# EAGLE design HH1D (EAGLE 9.6.2)
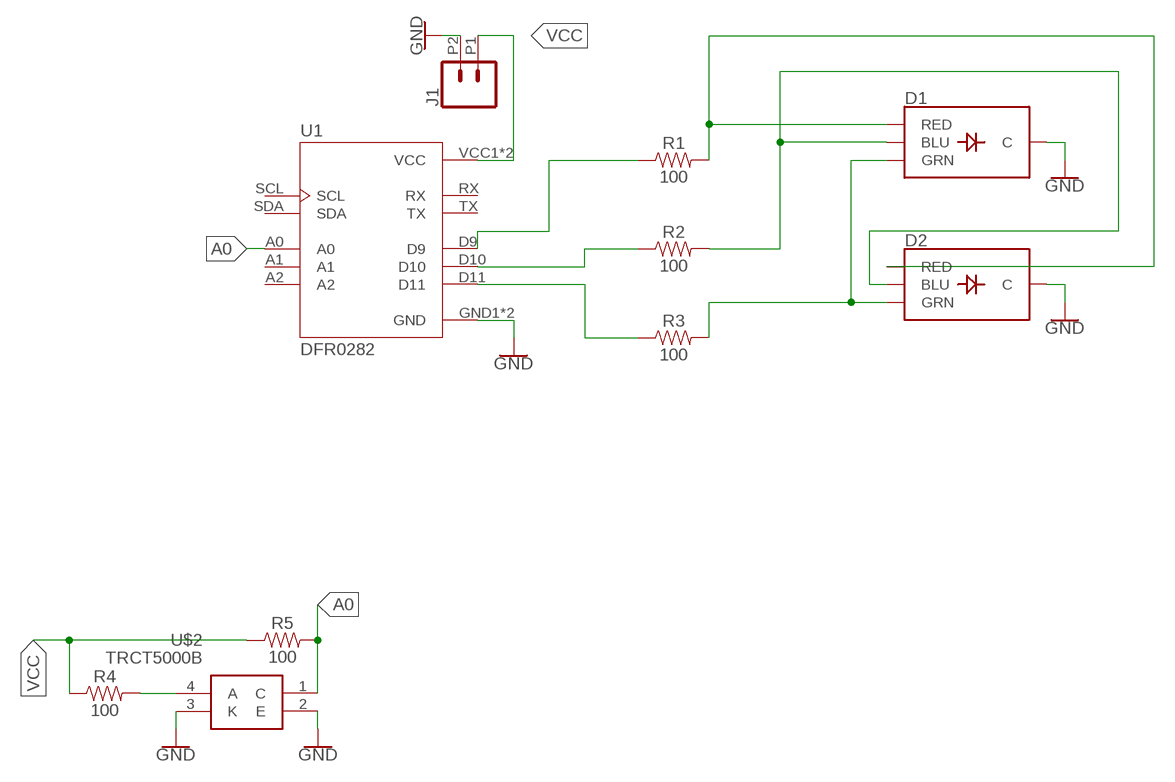
[diagram p0: schematic, sheet 1]

## Parts
D1  LED-RGB-CCPIRANHA  [LED_PIRANHA_5MM]
D2  LED-RGB-CCPIRANHA  [LED_PIRANHA_5MM]
J1  CONN_022.54MM_SCREWTERM  [1X02_2.54_SCREWTERM]
R1  100  100OHM-HORIZ-1/4W-1%  [AXIAL-0.3]
R2  100  100OHM-HORIZ-1/4W-1%  [AXIAL-0.3]
R3  100  100OHM-HORIZ-1/4W-1%  [AXIAL-0.3]
R4  100  100OHM-HORIZ-1/4W-1%  [AXIAL-0.3]
R5  100  100OHM-HORIZ-1/4W-1%  [AXIAL-0.3]
U1  DFR0282  [MODULE_DFR0282]
U$2  TRCT5000B  [TRCT5000B]

## Nets
A0: R5.P$2 U1.A0 U$2.1(C)
GND: D1.-(C) D2.-(C) J1.P2 U1.GND1(GND) U1.GND2(GND) U$2.2(E) U$2.3(K)
N$1: D1.R(RED) D2.R(RED) R1.P$2
N$2: D1.B(BLU) D2.B(BLU) R2.P$2
N$3: D1.G(GRN) D2.G(GRN) R3.P$2
N$4: R4.P$2 U$2.4(A)
N$6: R1.P$1 U1.D9
N$7: R2.P$1 U1.D10
N$9: R3.P$1 U1.D11
VCC: J1.P1 R4.P$1 R5.P$1 U1.VCC1(VCC) U1.VCC2(VCC)
Unconnected: U1.A1 U1.A2 U1.RX U1.SCL U1.SDA U1.TX

## Library data of the parts
D1 D2 = SparkFun-LED:LED-RGB-CC: LED-RGB Common Cathode Packages: LED RGB-THRU LED_PIRANHA_5MM SparkFun Products: RGB Diffused Common Cathode- Diffuse <[https://www.sparkfun.com/products/9264]> RGB Diffused Common Cathode - Clear <[https://www.sparkfun.com/products/105]> LED-RGB 5mm Square (Piranha) <[https://www.sparkfun.com/products/11679]>; SF_ID: COM-11679
J1 = SparkFun-Connectors:CONN_02: Multi connection point. Often used as Generic Header-pin footprint for 0.1 inch spaced/style header connections On any of the 0.1 inch spaced packages, you can populate with these: Break Away Headers - Straight <https://www.sparkfun.com/products/116> (PRT-00116) Break Away Male Headers - Right Angle <https://www.sparkfun.com/products/553> (PRT-00553) Female Headers <https://www.sparkfun.com/products/115> (PRT-00115) Break Away Headers - Machine Pin <https://www.sparkfun.com/products/117> (PRT-00117) Break Away Female Headers - Swiss Machine Pin <https://www.sparkfun.com/products/743> (PRT-00743) For SCREWTERMINALS and SPRING TERMINALS visit here: Screw Terimnals on SparkFun.com <https://www.sparkfun.com/search/results?term=Screw+Terminals> (5mm/3.5mm/2.54mm spacing) This device is also useful as a general connection point to wire up your design to another part of your project. Our various solder wires solder well into these plated through hole pads. Hook-Up Wire - Assortment (Stranded, 22 AWG) <https://www.sparkfun.com/products/11375> (PRT-11375) Hook-Up Wire - Assortment (Solid Core, 22 AWG) <https://www.sparkfun.com/products/11367> (PRT-11367) View the entire wire category on our website here <https://www.sparkfun.com/categories/141> Special notes: Molex polarized connector foot print use with: PRT-08233 with associated crimp pins and housings. 2.54_SCREWTERM for use with PRT-10571. 3.5mm Screw Terminal footprints for PRT-08084 5mm Screw Terminal footprints for use with PRT-08432
R1-R5 = SparkFun-Resistors:100OHM: 100Ω resistor A resistor is a passive two-terminal electrical component that implements electrical resistance as a circuit element. Resistors act to reduce current flow, and, at the same time, act to lower voltage levels within circuits. - Wikipedia; PROD_ID: RES-12181
U1 = DFR0282:DFR0282: CONTROLLER BOARD, BEETLE (1Pc) 16MHZ CLOCK SPEED, 20MMX22MM Check prices <https://pricing.snapeda.com/parts/DFR0282/DFRobot/view-part?ref=eda>; AVAILABILITY: In Stock; DESCRIPTION: ATmega32U4 Beetle AVR® ATmega AVR MCU 8-Bit Embedded Evaluation Board; MF: DFRobot; MP: DFR0282; PACKAGE: None; PRICE: None
U$2 = TCRT5000:TRCT5000B

## Board
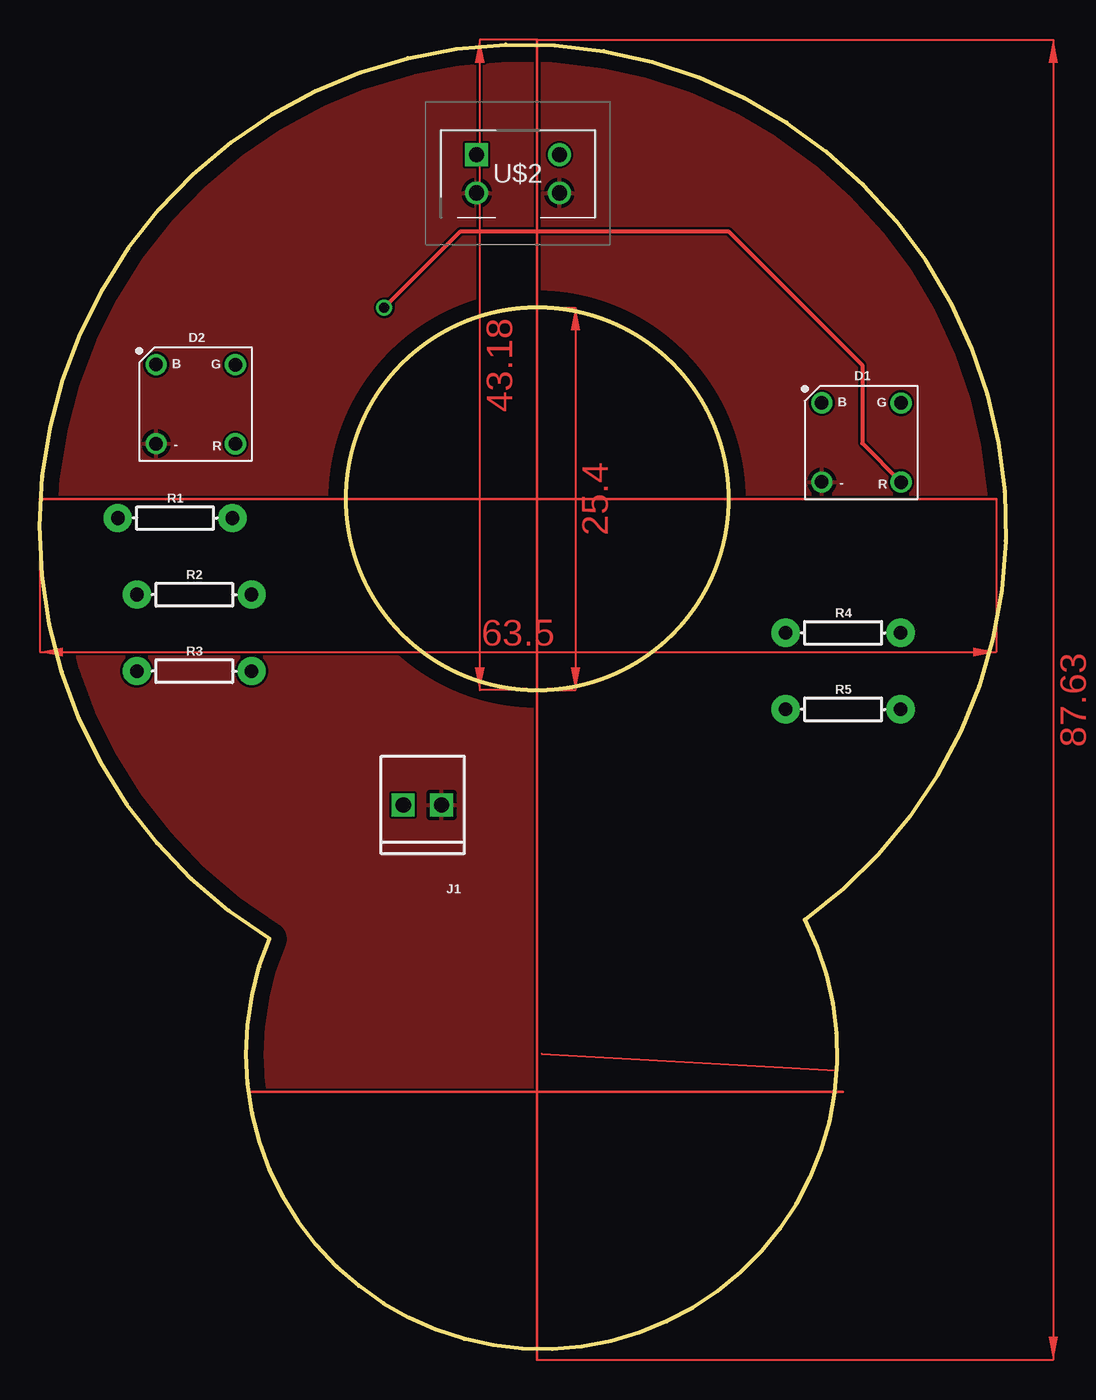
[diagram p1: board, top side]
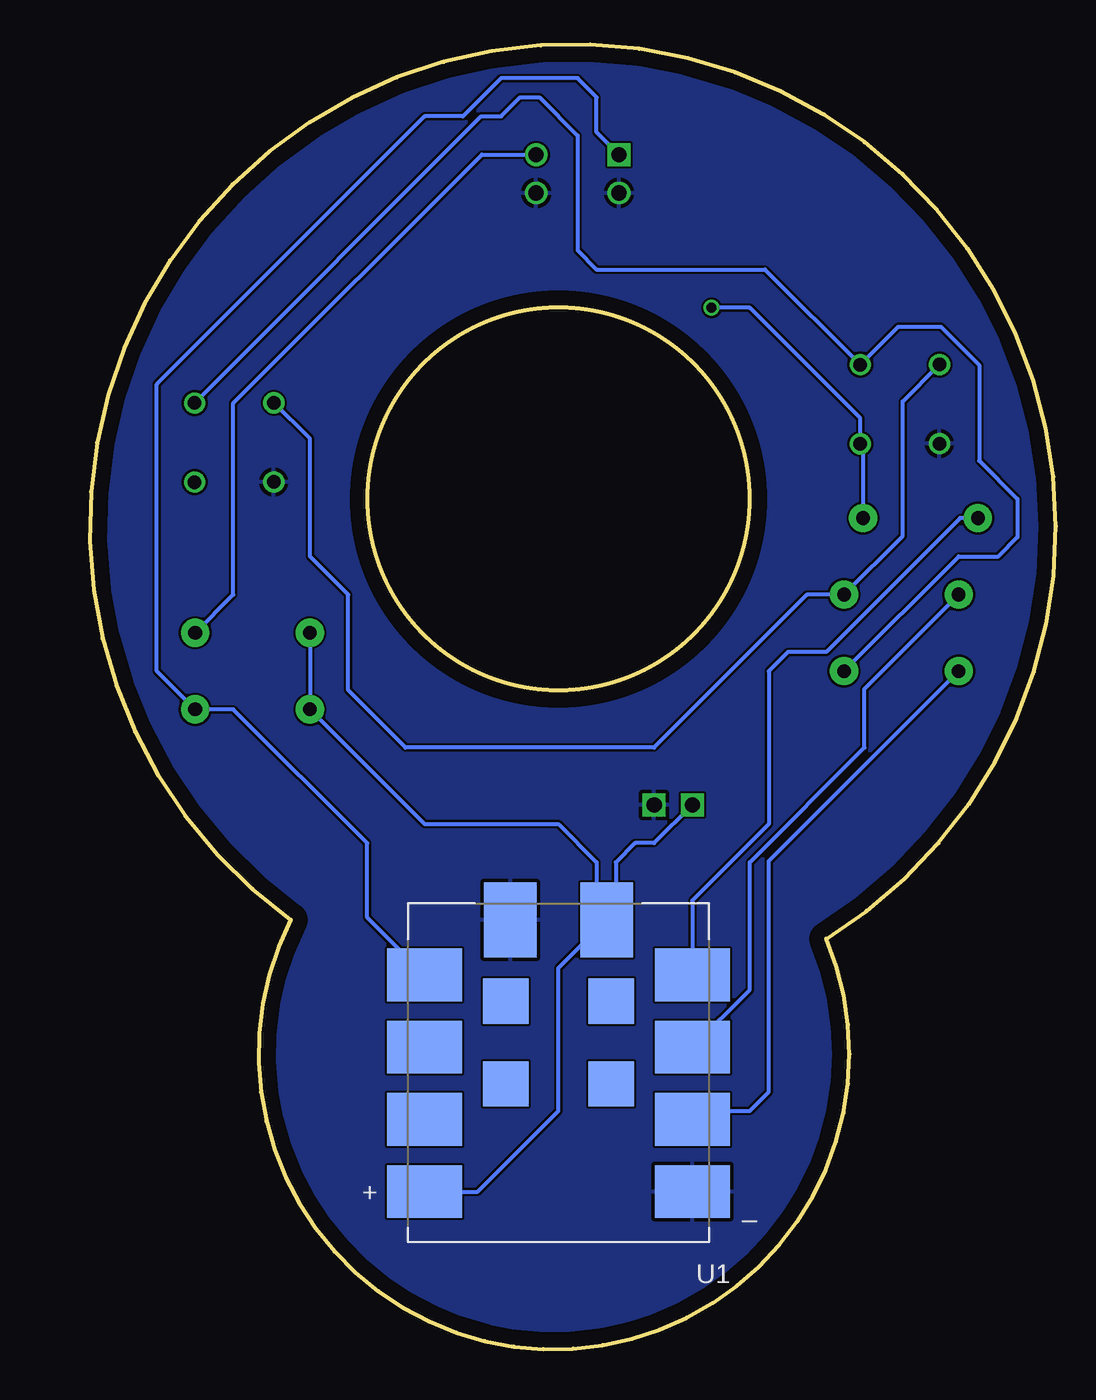
[diagram p2: board, bottom side, seen from below]

Size 64.16 x 86.63 mm. Coordinates in mm from the lower left corner, seen from the top.
Outline: 50.82,28.51 arc-230 15.26,27.24 arc-293 50.82,28.51
Outline: circle at 33.04,56.45 radius 12.7
Copper layers (1*16): Top 0.035mm / dielectric 1.5mm / Bottom 0.035mm
Design rules "default": minimum track width 6mil, minimum drill 0.35mm, track to track 6mil, track to pad 6mil, pad to pad 6mil, via to via 6mil, smd to smd 6mil, copper to edge 40mil, drill to drill 6mil, minimum pad ring 10mil, minimum via ring 8mil, stop-mask expansion 4mil, vias tented up to drill 0mil, thermal gap 10mil

### Footprints (pad centres in the part's own frame; a part is rotated, then mirrored left to right if it is on the bottom)
LED_PIRANHA_5MM = drill 0.9: - -2.684,-2.684; B -2.688,2.574; G 2.575,2.562; R 2.579,-2.696
1X02_2.54_SCREWTERM = drill 1.016 square: P1 2.54,0; P2 0,0
AXIAL-0.3 = drill 0.9 pad 1.88: P$1 -3.81,0; P$2 3.81,0
MODULE_DFR0282 = smd 5 x 3.5: A0 8.9,-6.5; A1 8.9,-1.7; A2 8.9,3.1; D9 -8.9,-6.5; D10 -8.9,-1.7; D11 -8.9,3.1; GND1 -8.9,7.9; VCC1 8.9,7.9 | smd 3.5 x 5: GND2 3.2,-10.15; VCC2 -3.2,-10.15 | smd 3 x 3: RX -3.5,-4.75; SCL 3.5,0.75; SDA 3.5,-4.75; TX -3.5,0.75
TRCT5000B = drill 1 pad 1.5 square: 1 3.6,6.35 | drill 1 pad 1.5: 2 3.6,3.81; 3 9.1,3.81; 4 9.1,6.35

### Placement (x,y rotation side)
D1  54.63,60.26 0 top
D2  10.42,62.8 0 top
J1  26.69,36.13 180 top
R1  8.99,55.18 0 top
R2  10.26,50.1 0 top
R3  10.26,45.02 0 top
R4  53.36,47.56 0 top
R5  53.36,42.48 0 top
U1  33.04,18.35 180 bottom
U$2  25.42,72.96 0 top

### Tracks (layer width: path | path; a pad name or v marks a point on that pad's centre or on a via)
A0
  Bottom 0.254: U1.A0 45.74,28.65 45.74,33.59 54.63,42.48 R5.P$2 59.71,45.02 59.71,64.07 41.93,81.85 39.39,81.85 36.85,84.39 31.77,84.39 30.5,83.12 30.5,80.79 U$2.1
GND
  pour Bottom: -2.52,93.28 71.14,93.28 72.41,92.01 72.41,-3.24 -3.79,-3.24 -5.06,-1.97 -5.06,90.74
  pour Top: -3.79,93.28 71.14,93.28 71.14,-3.24 -3.79,-3.24 -5.06,-1.97 -5.06,92.01
N$1  (via drill 0.65)
  Top 0.254: v22.88,69.15 27.96,74.23 45.74,74.23 54.63,65.34 54.63,60.15 D1.R
  Bottom 0.254: R1.P$2 12.8,59.91 D2.R 13,61.81 20.34,69.15 v22.88,69.15
N$2
  Bottom 0.254: D2.B 10.18,62.93 10.18,54 R2.P$2 16.53,50.1 26.69,39.94 43.2,39.94 47.01,43.75 47.01,50.1 49.55,52.64 49.55,60.45 D1.B
N$3
  Bottom 0.254: R3.P$2 6.45,52.64 3.83,52.64 2.56,53.91 2.56,56.45 5.1,58.99 5.1,65.34 7.64,67.88 10.48,67.88 D2.G 19.32,71.69 30.5,71.69 31.77,72.96 31.77,80.58 34.31,83.12 35.58,83.12 36.85,81.85 38.18,81.85 D1.G
N$4
  Bottom 0.254: R4.P$2 54.63,50.1 54.63,62.8 38.12,79.31 U$2.4
N$6
  Bottom 0.254: R1.P$1 6.37,55.18 15.26,46.29 17.8,46.29 19.07,45.02 19.07,34.86 24.15,29.78 24.15,24.7 22.88,24.7 23.03,24.85 U1.D9
N$7
  Bottom 0.254: R2.P$1 12.72,43.84 12.72,39.94 20.34,32.32 20.34,23.85 U1.D10
N$9
  Bottom 0.254: U1.D11 23.58,15.81 20.34,15.81 19.07,17.08 19.07,32.41 R3.P$1
S$1
  Top 0.152: 33.04,86.93 33.04,17.08 33.04,0.57 33.04,-0.7
S$2
  Top 0.152: 0.02,56.45 63.52,56.45
S$3
  Top 0.152: 13.99,17.08 53.36,17.08
VCC
  Bottom 0.254: R4.P$1 R5.P$1 41.93,34.86 33.04,34.86 30.5,32.32 30.5,29.16 30.17,28.84 | 30.17,28.84 U1.VCC2 33.04,25.3 33.04,15.81 38.4,10.45 U1.VCC1 | J1.P1 26.69,33.59 27.96,33.59 29.23,32.32 29.23,29.78 30.17,28.84
(copper drawn outside any net)
  shapes: Top area x5